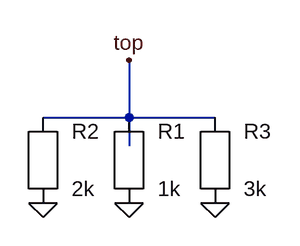
[diagram p0: schematic pin_at_crossing.asc]
pin_at_crossing.asc, the LTspice schematic file:
Version 4
SHEET 1 880 680
WIRE 0 96 192 96
WIRE 96 32 96 128
SYMBOL res 96 144 R0
SYMATTR InstName R1
SYMATTR Value 1k
SYMBOL res 0 144 R0
SYMATTR InstName R2
SYMATTR Value 2k
SYMBOL res 192 144 R0
SYMATTR InstName R3
SYMATTR Value 3k
FLAG 96 192 0
FLAG 0 192 0
FLAG 192 192 0
FLAG 96 32 top

The netlist it stands for:
* pin_at_crossing.asc
R1 top 0 1k
R2 top 0 2k
R3 top 0 3k
.backanno
.end